# Altium schematic sheet Sheet1.SchDoc
size A4
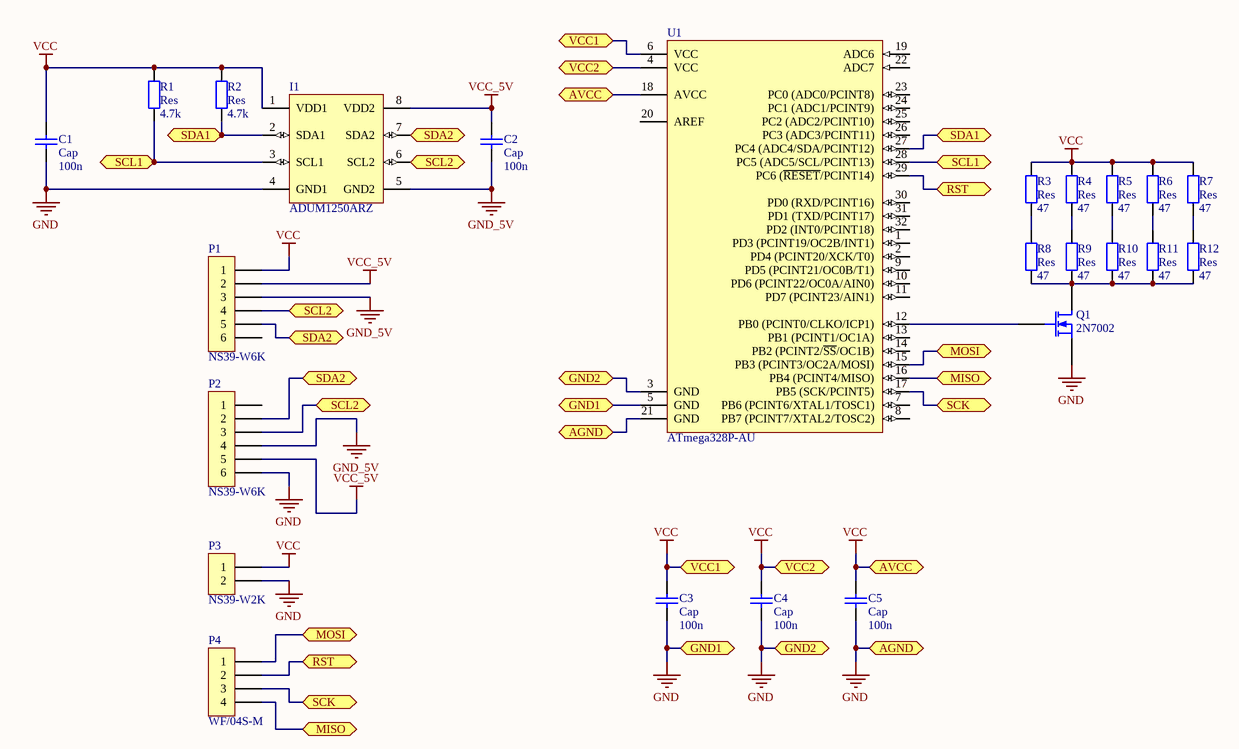
[diagram p0: Sheet1.SchDoc]

## Parts
C1  Cap  value 100n  [C0805]
C2  Cap  value 100n  [C0805]
C3  Cap  value 100n  [C0805]
C4  Cap  value 100n  [C0805]
C5  Cap  value 100n  [C0805]
I1  ADUM1250ARZ  [SO8_N]
P1  NS39-W6K  [NS39-W6K]
P2  NS39-W6K  [NS39-W6K]
P3  NS39-W2K  [NS39-W2k]
P4  WF/04S-M  [WF/04S-M]
Q1  2N7002  [SOT-23_N]
R1  Res  value 4.7k  [6-0805_N]
R2  Res  value 4.7k  [6-0805_N]
R3  Res  value 47  [6-0805_N]
R4  Res  value 47  [6-0805_N]
R5  Res  value 47  [6-0805_N]
R6  Res  value 47  [6-0805_N]
R7  Res  value 47  [6-0805_N]
R8  Res  value 47  [6-0805_N]
R9  Res  value 47  [6-0805_N]
R10  Res  value 47  [6-0805_N]
R11  Res  value 47  [6-0805_N]
R12  Res  value 47  [6-0805_N]
U1  ATmega328P-AU  [32A_N]

## Ports
AGND, AVCC, GND1, GND2, MISO, MOSI, RST, SCK, SCL1, SCL2, SDA1, SDA2, VCC1, VCC2

## Nets
GND: C1.2 C3.2 C4.2 C5.2 I1.4(GND1) P2.6 P3.2 Q1.2(S) U1.3(GND) U1.5(GND) U1.21(GND) ; port GND2, port GND1, port AGND
GND_5V: C2.2 I1.5(GND2) P1.3 P2.4
VCC: C1.1 C3.1 C4.1 C5.1 I1.1(VDD1) P1.1 P3.1 R1.2 R2.2 R3.2 R4.2 R5.2 R6.2 R7.2 U1.4(VCC) U1.6(VCC) U1.18(AVCC) ; port VCC1, port VCC2, port AVCC
VCC_5V: C2.1 I1.8(VDD2) P1.2 P2.5
MISO: P4.4 U1.16(PB4_(PCINT4/MISO)) ; port MISO
MOSI: P4.1 U1.15(PB3_(PCINT3/OC2A/MOSI)) ; port MOSI
RST: P4.2 U1.29(PC6_(~{RESET}/PCINT14)) ; port RST
SCK: P4.3 U1.17(PB5_(SCK/PCINT5)) ; port SCK
SCL1: I1.3(SCL1) R1.1 U1.28(PC5_(ADC5/SCL/PCINT13)) ; port SCL1
SCL2: I1.6(SCL2) P1.4 P2.3 ; port SCL2
SDA1: I1.2(SDA1) R2.1 U1.27(PC4_(ADC4/SDA/PCINT12)) ; port SDA1
SDA2: I1.7(SDA2) P1.5 P2.2 ; port SDA2
NetQ1_1: Q1.1(G) U1.12(PB0_(PCINT0/CLKO/ICP1))
NetQ1_3: Q1.3(D) R8.1 R9.1 R10.1 R11.1 R12.1
NetR3_1: R3.1 R8.2
NetR4_1: R4.1 R9.2
NetR5_1: R5.1 R10.2
NetR6_1: R6.1 R11.2
NetR7_1: R7.1 R12.2

Not connected (* = marked no-connect by the designer): P1 6; P2 1; U1 1(PD3_(PCINT19/OC2B/INT1)) 2(PD4_(PCINT20/XCK/T0)) 7(PB6_(PCINT6/XTAL1/TOSC1)) 8(PB7_(PCINT7/XTAL2/TOSC2)) 9(PD5_(PCINT21/OC0B/T1)) 10(PD6_(PCINT22/OC0A/AIN0)) 11(PD7_(PCINT23/AIN1)) 13(PB1_(PCINT1/OC1A)) 14(PB2_(PCINT2/~{SS}/OC1B)) 19(ADC6) 20(AREF) 22(ADC7) 23(PC0_(ADC0/PCINT8)) 24(PC1_(ADC1/PCINT9)) 25(PC2_(ADC2/PCINT10)) 26(PC3_(ADC3/PCINT11)) 30(PD0_(RXD/PCINT16)) 31(PD1_(TXD/PCINT17)) 32(PD2_(INT0/PCINT18))

## Library data of the parts
C1-C5 = Cap: Capacitor; Published: 8-Jun-2000; LatestRevisionDate: 17-Jul-2002; LatestRevisionNote: Re-released for DXP Platform.; PackageReference: RAD-0.3; Publisher: Altium Limited; PackageDescription: Radial Cap, Thru-Hole; 2 Leads; 0.3 in Pin Spacing
I1 = ADUM1250: Hot Swappable, Dual I2C Isolator
P1 P2 = NS39-W6K: Socket
P3 = NS39-W2K: Socket
P4 = WF/04S-M: Socket
Q1 = MOSFET-N: N-Channel MOSFET; Published: 8-Jun-2000; LatestRevisionDate: 17-Jul-2002; LatestRevisionNote: Re-released for DXP Platform.; PackageVersion: 1995/1996; PackageReference: E3; Publisher: Altium Limited; PackageDescription: TO, Flat Index; 3 In-Line, Axial Leads; Body Dia. 4.6mm; Lead Dia. 0.5 mm (max)
R1-R12 = Res2: Resistor; Published: 8-Jun-2000; LatestRevisionDate: 17-Jul-2002; LatestRevisionNote: Re-released for DXP Platform.; PackageReference: AXIAL-0.4; Publisher: Altium Limited; PackageDescription: Axial Device, Thru-Hole; 2 Leads; 0.4 in Pin Spacing
U1 = ATmega328P-AU: 8-bit AVR Microcontroller, 32KB Flash, 1KB EEPROM, 2KB SRAM, 32-pin TQFP, Industrial Grade (-40°C to 85°C); Published: 1-Apr-2010; DatasheetVersion: revA, Jan-2010; PackageVersion: revB, Oct-2001; PackageReference: 32A; Publisher: Altium Limited; PackageDescription: 32-Lead, 7x7x1.0 mm Body, 0.8mm Lead Pitch, Thin Profile Plastic Quad Flat Package (TQFP); Supplier 1: Digi-Key; Supplier Part Number 1: ATMEGA328P-AU-ND; Supplier 2: Farnell; Supplier Part Number 2: 1715486; Supplier 3: Mouser; Supplier Part Number 3: 556-ATMEGA328P-AU; Code_JEDEC: MS-026-ABA; ComponentLink1Description: Manufacturer Link; ComponentLink1URL: http://www.atmel.com/products/avr/default.asp?; ComponentLink2Description: ATmega48A/48PA/88A/88PA/168A/168PA/328/328P Datasheet; ComponentLink2URL: http://www.atmel.com/dyn/resources/prod_documents/8271.pdf; ComponentLink3Description: ATmega48A/48PA/88A/88PA/168A/168PA/328/328P Summary; ComponentLink3URL: http://www.atmel.com/dyn/resources/prod_documents/8271S.pdf; ComponentLink4Description: Atmel.com Home; ComponentLink4URL: http://www.atmel.com